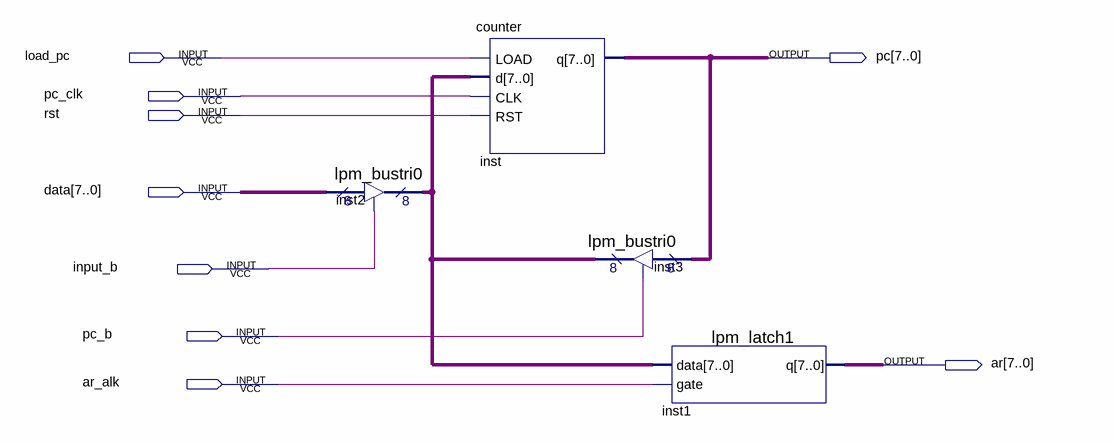
[diagram p0: schematic sheet]
// Quartus schematic pc_ar.bdf as structural Verilog: 4 symbols, 9 pins
module pc_ar (
  input  load_pc,
  input  pc_clk,
  input  rst,
  input  [7:0] data,
  input  input_b,
  input  pc_b,
  input  ar_alk,
  output [7:0] pc,
  output [7:0] ar
);

  wire [7:0] inst2_tridata;

  lpm_bustri0 inst2 (.enabledt(input_b), .data(data), .tridata(inst2_tridata));
  counter inst (.LOAD(load_pc), .d(inst2_tridata), .CLK(pc_clk), .RST(rst), .q(pc));
  lpm_bustri0 inst3 (.enabledt(pc_b), .data(pc), .tridata(inst2_tridata));
  lpm_latch1 inst1 (.data(inst2_tridata), .gate(ar_alk), .q(ar));
endmodule
